# EAGLE design led-cc-driver-mk-3.0 (EAGLE 7.5.0)
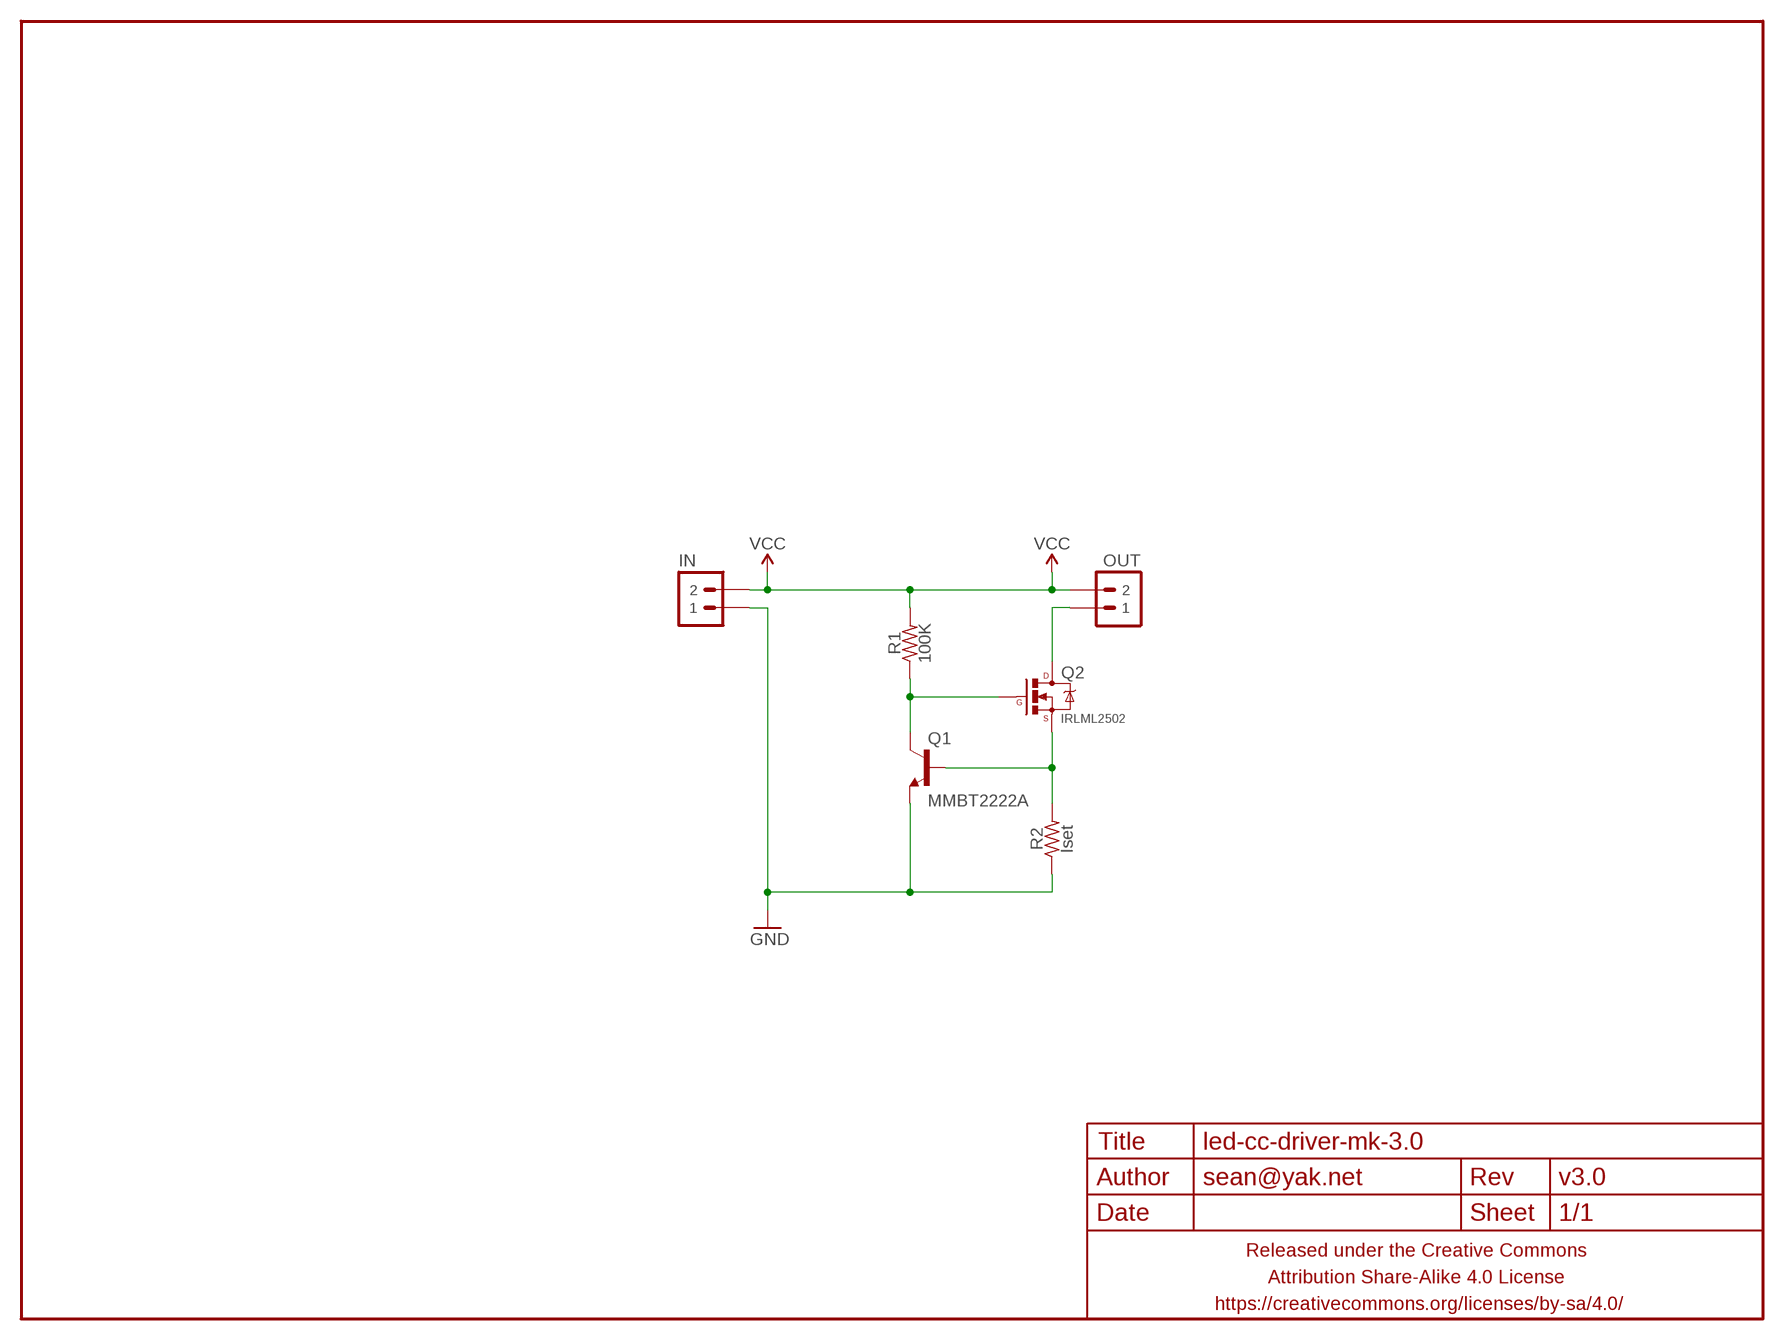
[diagram p0: schematic, sheet 1]

## Parts
FRAME1  FRAME-LETTERNO_PACKAGE  [DUMMY]
IN  M02PTH-CENTERED  [1X02-CENTER]
OUT  M02PTH-CENTERED  [1X02-CENTER]
Q1  MMBT2222A  TRANSISTOR_NPNMMBT2222A  [SOT23]
Q2  IRLML2502  MOSFET-NCHANNELIRLML2502  [SOT23]
R1  100K  RESISTORR0603  [R0603]
R2  Iset  RESISTORR0603  [R0603]

## Nets
GND: IN.1 Q1.2(E) R2.1
N$1: Q1.3(C) Q2.1(G) R1.1
N$2: Q1.1(B) Q2.2(S) R2.2
N$4: OUT.1 Q2.3(D)
VCC: IN.2 OUT.2 R1.2

## Library data of the parts
FRAME1 = A_butts:FRAME-LETTER: Schematic Frame Standard 8.5x11 US Letter frame; DESIGNER: sean@yak.net; VERSION: v3.0
IN OUT = a_parts:M02: Standard 2-pin 0.1" header. Use with - straight break away headers ( PRT-00116) - right angle break away headers (PRT-00553) - swiss pins (PRT-00743) - machine pins (PRT-00117) - female headers (PRT-00115) Molex polarized connector foot print use with: PRT-08233 with associated crimp pins and housings. 2.54_SCREWTERM for use with PRT-10571. 3.5mm Screw Terminal footprints for PRT-08084 5mm Screw Terminal footprints for use with PRT-08433
Q1 = a_parts:TRANSISTOR_NPN: Generic NPN BJT MMBT2222A - TRANS-08049 (SOT-23, 1A 40V) MPSA42 - TRANS-09116 (SOT-23, 500mA 300V) MMBT5088LT1G - TRANS-11160 (SOT-23, 50 mA 30V) BC547 - COM-08928 <http://www.sparkfun.com/products/8928> (TO-92 45V 100mA) (1.Collector 2.Base 3.Emitter) 2N3904 - COM-00521 <http://www.sparkfun.com/products/521> (TO-92 40V 200mA) (1.Emitter 2.Base 3.Collector) P2N2222A - COM-12852 <http://www.sparkfun.com/products/12852> (TO-92 40V 600mA) (1.Collector 2.Base 3.Emitter)
Q2 = a_parts:MOSFET-NCHANNEL: Common NMOSFET Parts MFG P/N Store ID Prod ID FDD8780 TRANS-09984 SI7820DN TRANS-11055 FDS6630A IC-08089 2N7002PW TRANS-11151 FQP30N06L COM-10213 TRANS-10060 BSS123LT1G TRANS-08345 BSS138 TRANS-00830 BS170 2N7000
R1 R2 = a_parts:RESISTOR: RESISTOR, American symbol

## Board
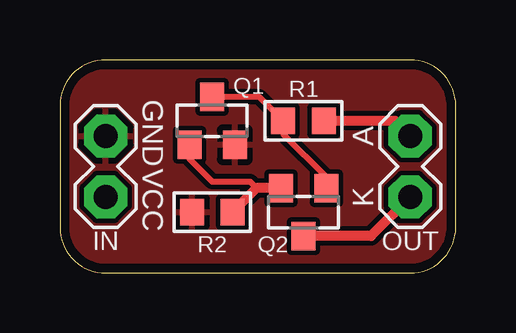
[diagram p1: board, top side]
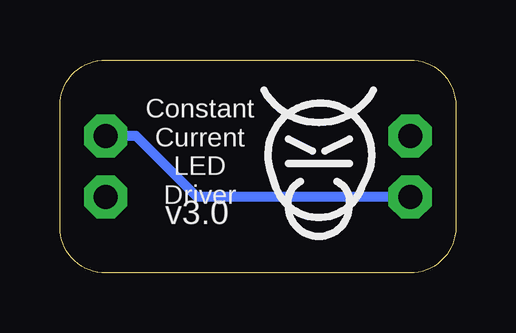
[diagram p2: board, bottom side, seen from below]

Size 16.51 x 8.89 mm. Coordinates in mm from the lower left corner, seen from the top.
Outline: 0,6.99 0,1.91 arc90 1.91,0 14.61,0 arc90 16.51,1.91 16.51,6.99 arc90 14.61,8.89 1.91,8.89 arc90 0,6.99
Copper layers (1*16): Top 0.0356mm / dielectric 1.5011mm / Bottom 0.0356mm
Design rules "LaenPCBOrder_2": minimum track width 6mil, minimum drill 13mil, track to track 6mil, track to pad 6mil, pad to pad 6mil, via to via 6mil, smd to smd 6mil, copper to edge 15mil, drill to drill 6mil, minimum pad ring 7mil, minimum via ring 7mil, stop-mask expansion 3mil, vias tented up to drill 20mil, thermal gap 10mil

### Footprints (pad centres in the part's own frame; a part is rotated, then mirrored left to right if it is on the bottom)
1X02-CENTER = drill 1 pad 1.8 octagon: 1 -1.27,0; 2 1.27,0
SOT23 = smd 1 x 1.2: 1 -0.95,-1; 2 0.95,-1; 3 0,1
R0603 = smd 1 x 1.1: 1 -0.85,0; 2 0.85,0

### Placement (x,y rotation side)
FRAME1  0,0 0 top
IN  1.91,4.45 270 top
OUT  14.61,4.45 90 top
Q1  6.35,6.35 0 top
Q2  10.16,2.54 180 top
R1  10.16,6.35 0 top
R2  6.35,2.54 0 top
U$1  [COW_SMALL_NOTEXT]  5.71,5.08 0 bottom

### Tracks (layer width: path | path; a pad name or v marks a point on that pad's centre or on a via)
GND
  pour Top (isolate 0.2): 1.91,8.89 14.61,8.89 arc-90 16.51,6.99 16.51,1.91 arc-90 14.61,0 1.91,0 arc-90 0,1.91 0,6.99 arc-90
N$1
  Top 0.254: Q1.3 8.31,7.35 R1.1 9.31,5.8 11.11,4 Q2.1
N$2
  Top 0.254: Q1.1 5.4,4.76 6.35,3.81 7.93,3.81 8.2,3.54
  Top 0.406: Q2.2 8.2,3.54 R2.2
N$4
  Top 0.406: OUT.1 12.97,1.54 Q2.3
VCC
  Top 0.406: R1.2 13.97,6.35 OUT.2
  Bottom 0.406: IN.2 10.79,3.17 13.34,5.71 OUT.2

### Text on the board
tPlace: GND | A | VCC | K
bPlace: Constant / Current / LED / Driver